# EAGLE board LogicPCB (EAGLE 9.4.2)
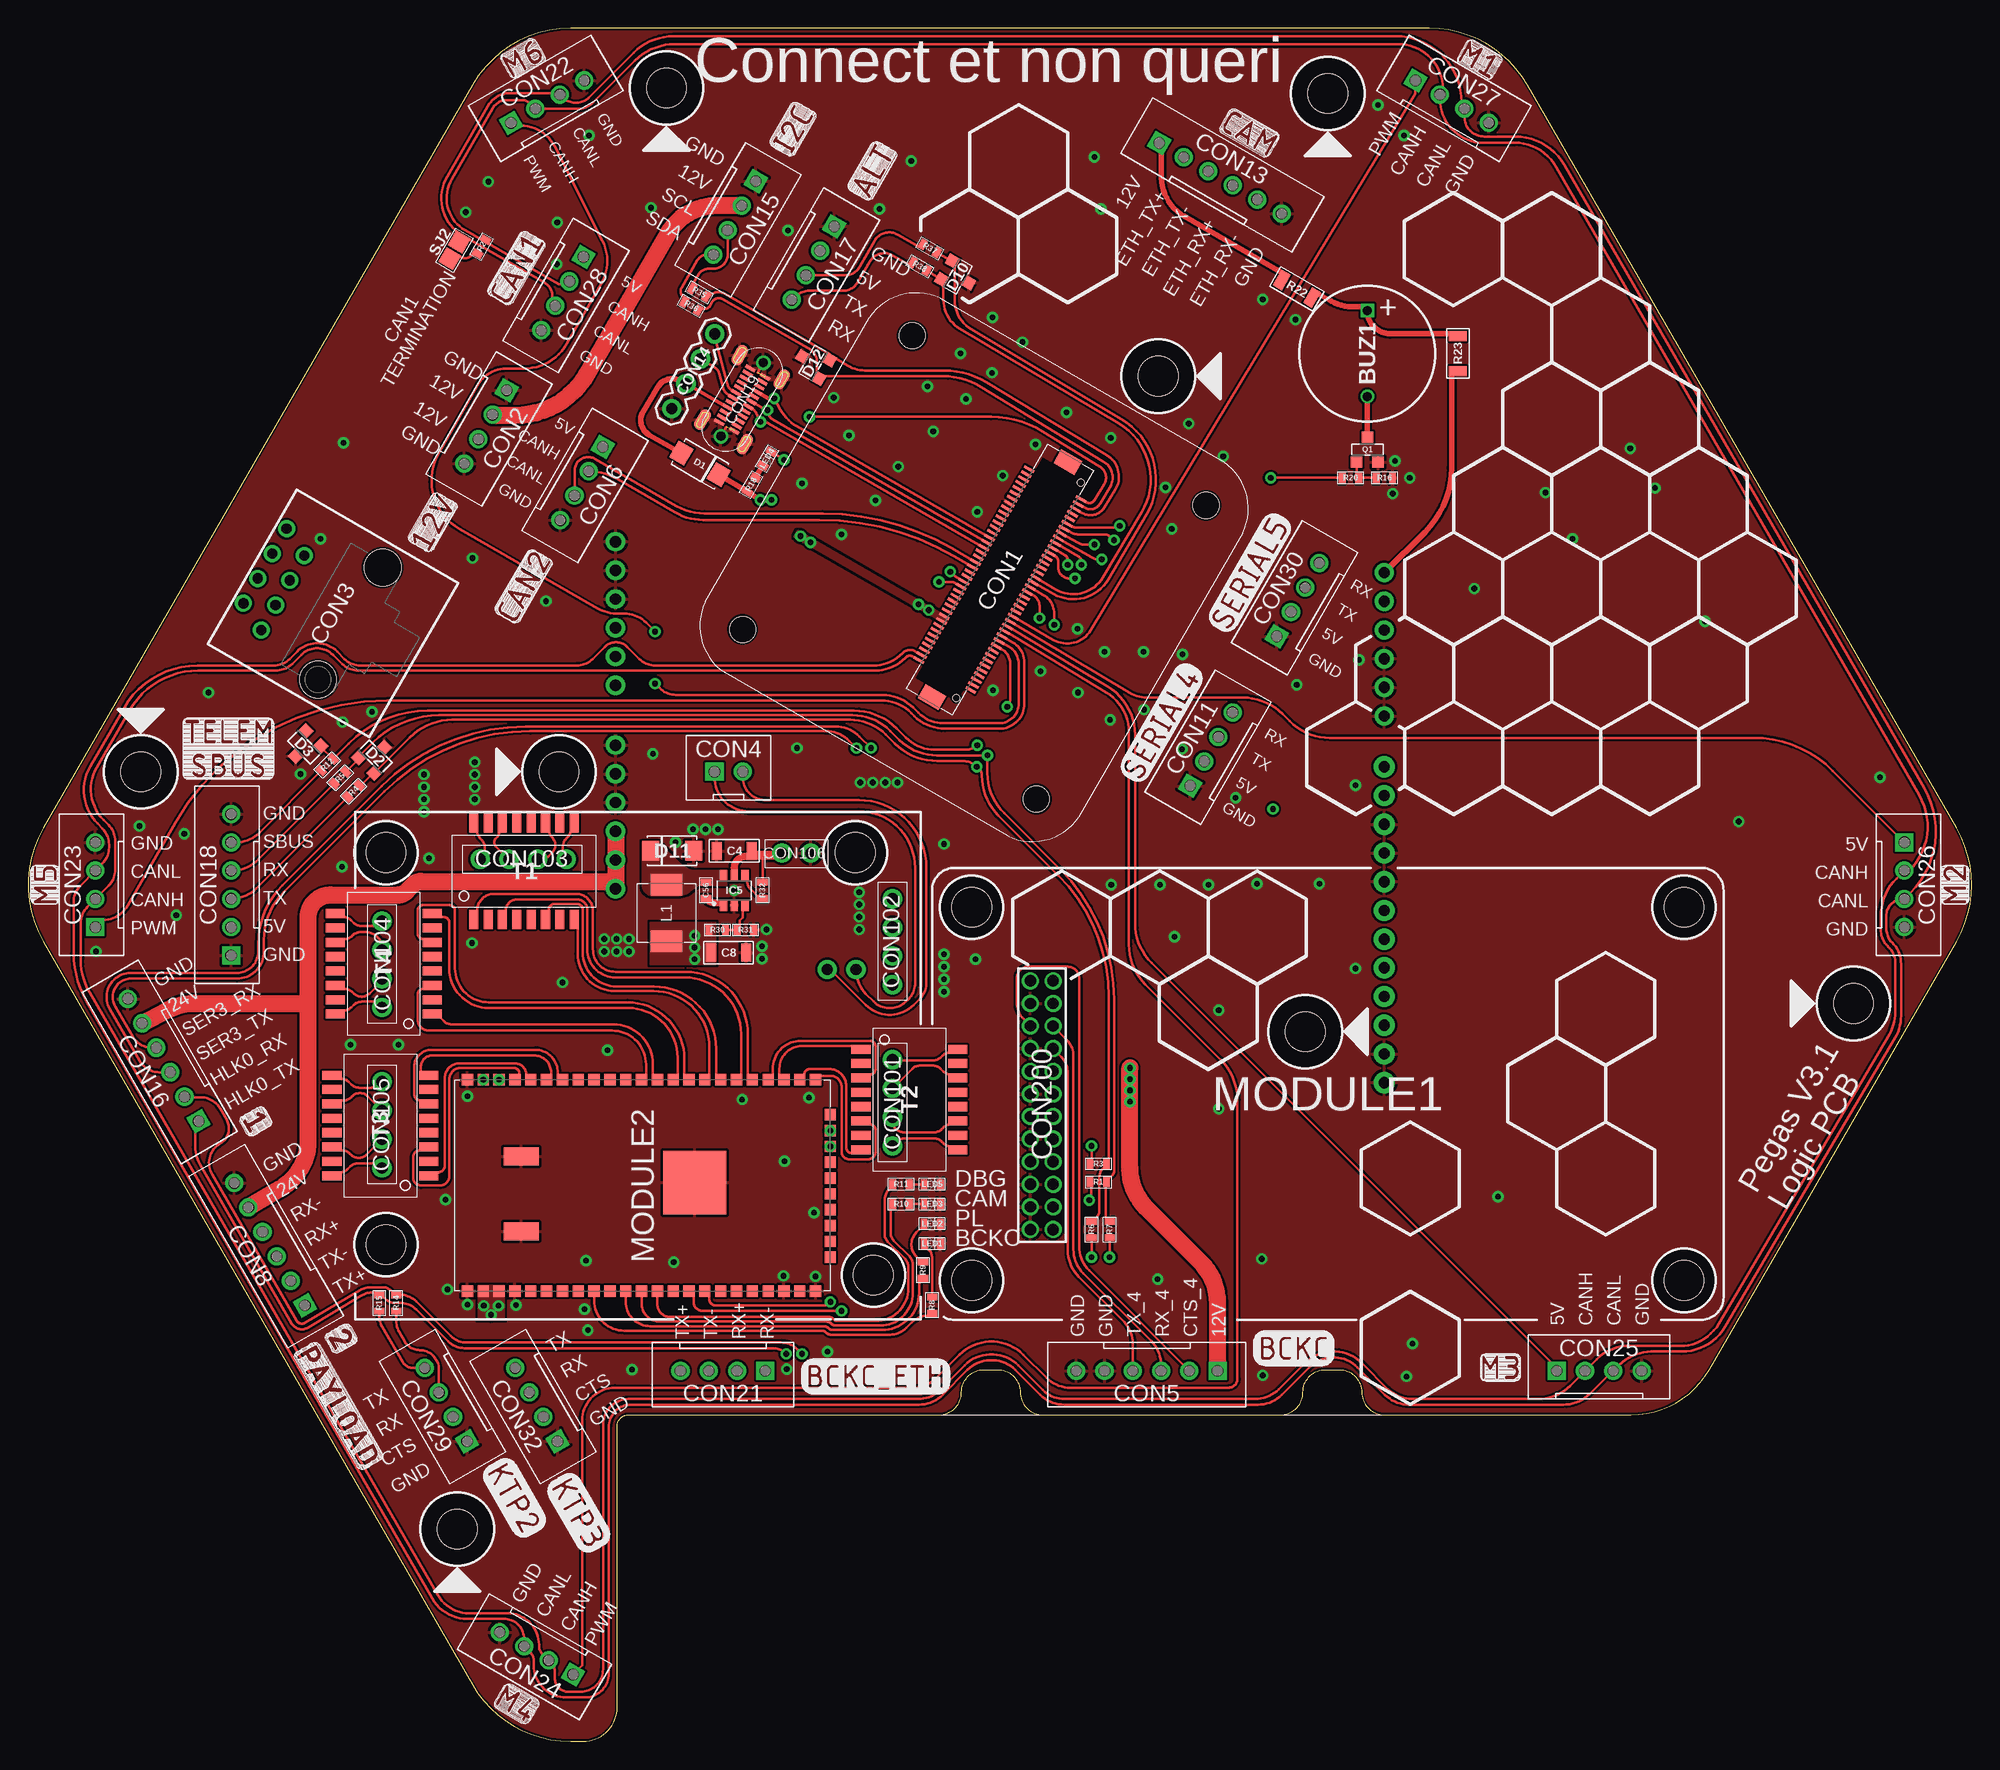
[diagram p2: board, top side]
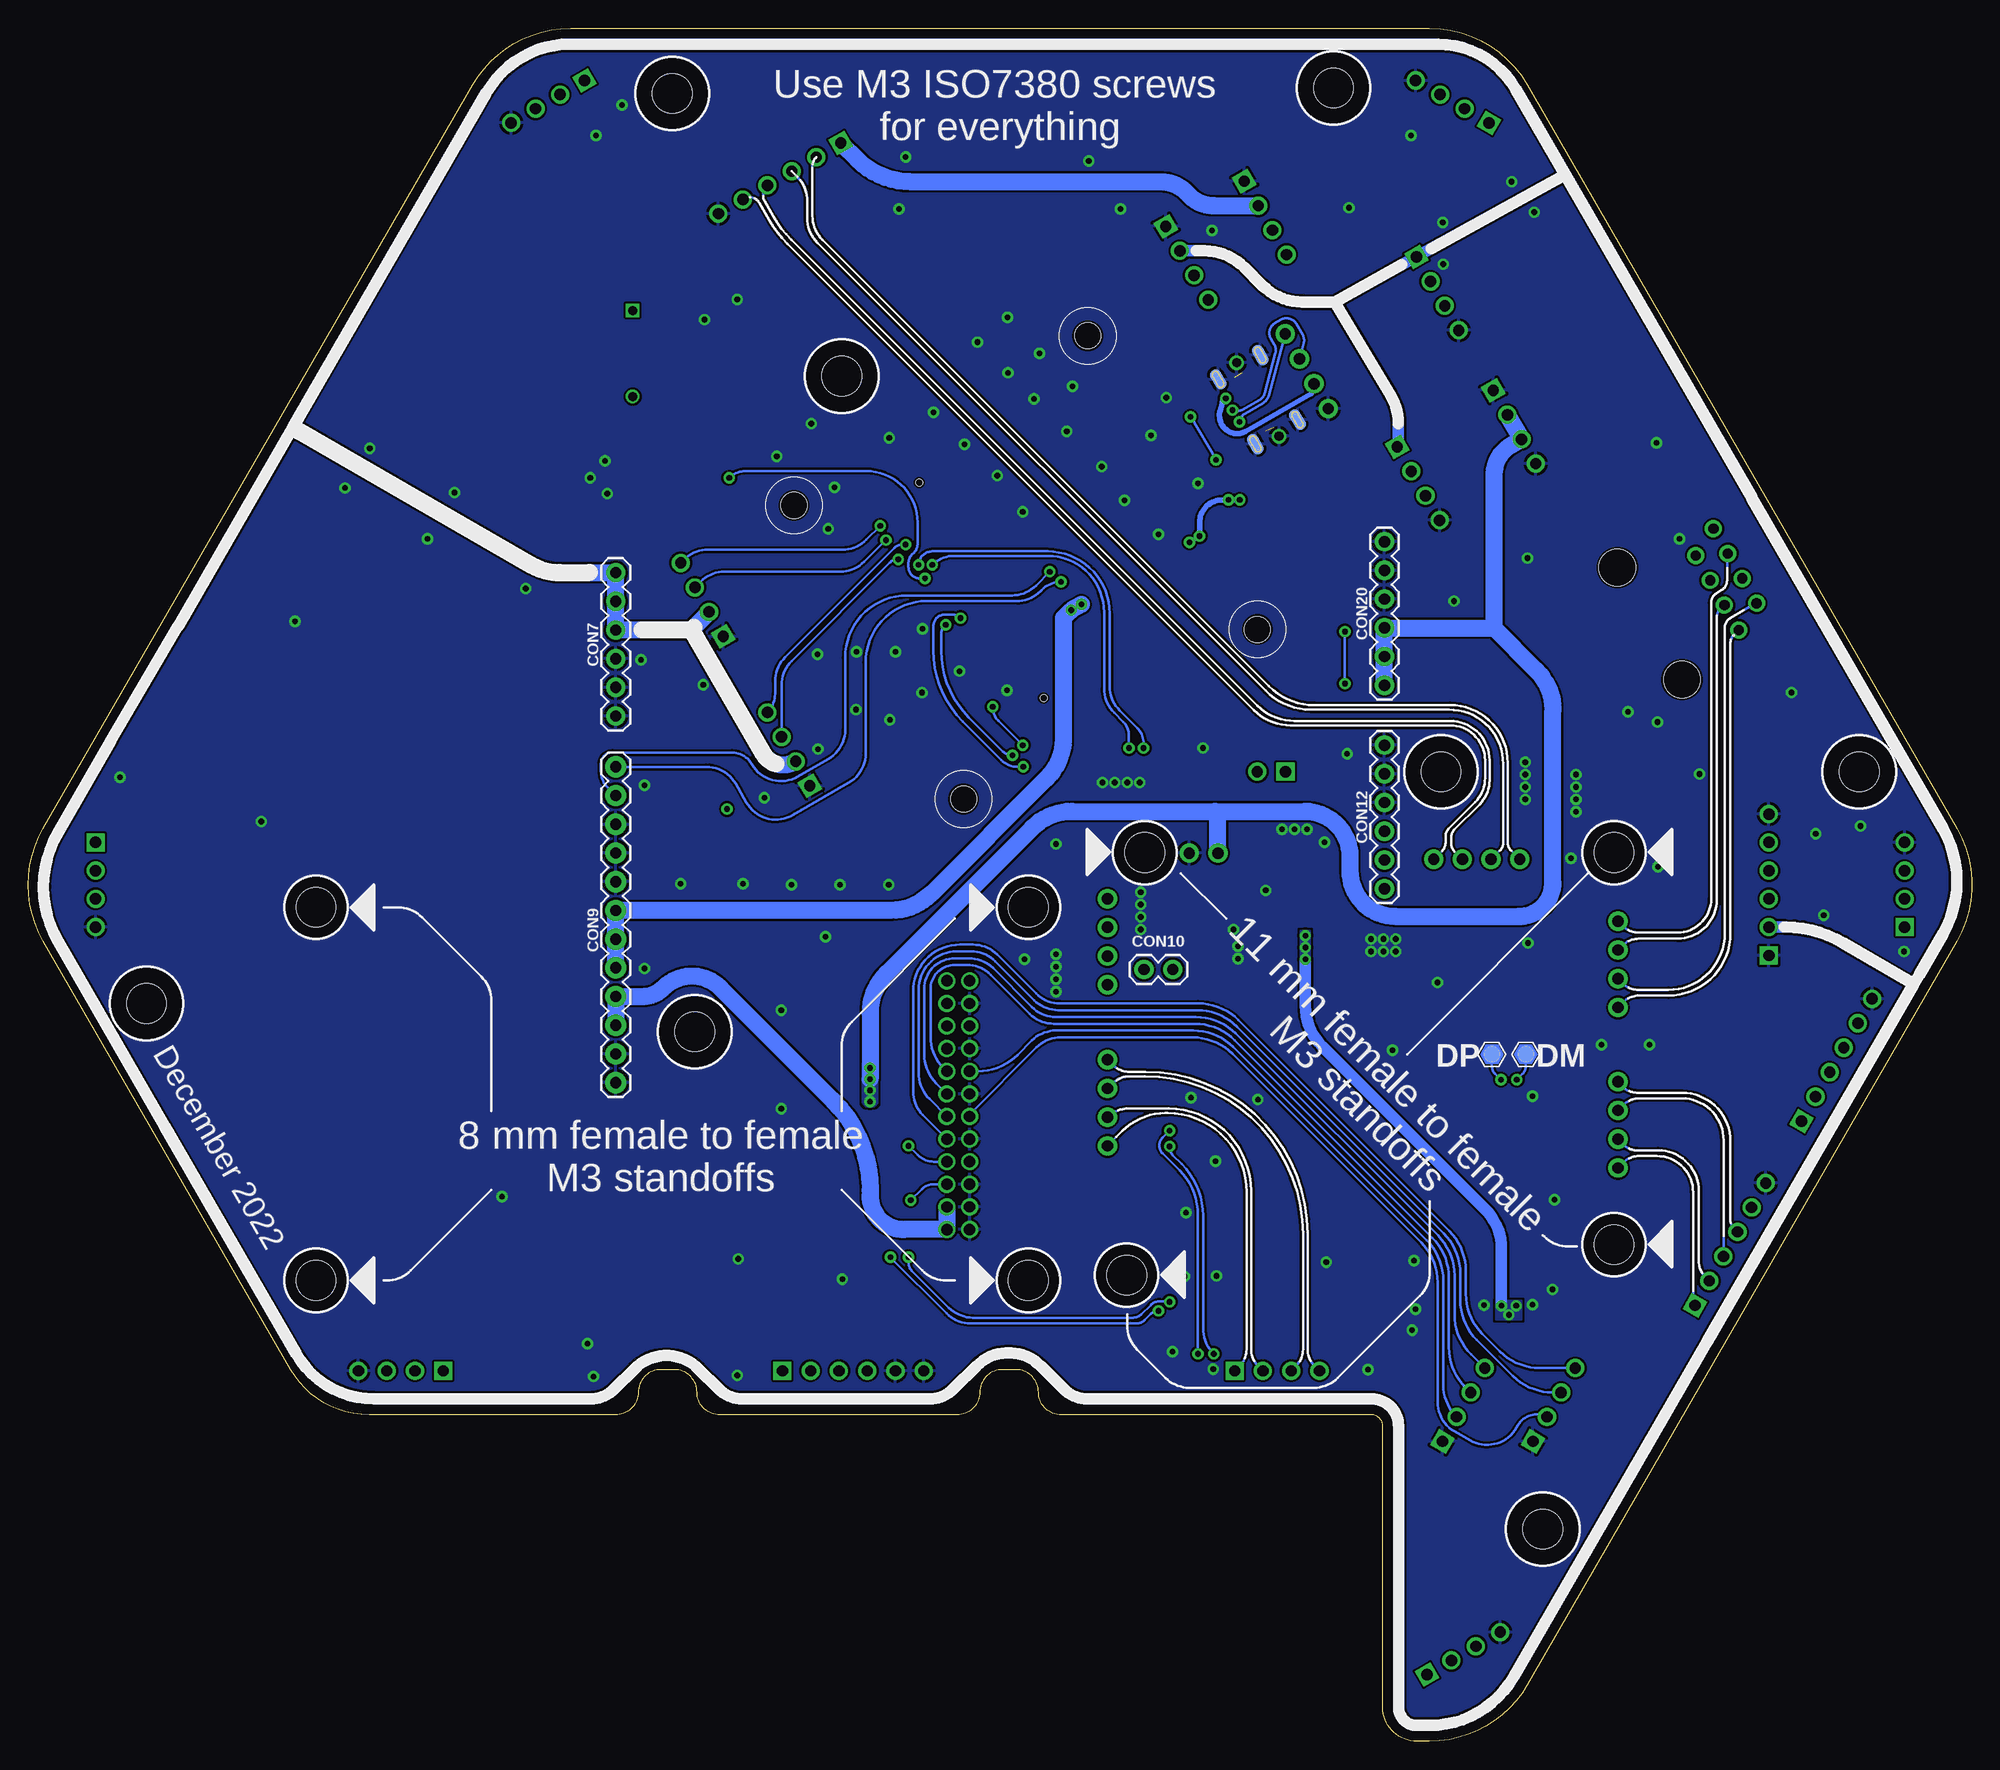
[diagram p3: board, bottom side, seen from below]

Size 171.89 x 151.55 mm. Coordinates in mm from the lower left corner, seen from the top.
Outline: 47.97,0 49.09,0 arc90 52.09,3 52.09,27.88 arc-90 53.09,28.88 80.54,28.88 arc90 82.54,30.88 arc-90 84.54,32.88 85.74,32.88 arc-90 87.74,30.88 arc90 89.74,28.88 110.74,28.88 arc90 112.74,30.88 arc-90 114.74,32.88 115.94,32.88 arc-90 117.94,30.88 arc90 119.94,28.88 141.75,28.88 arc60 148.68,32.88 170.55,70.78 arc60 170.55,80.78 132.58,146.55 arc60 123.92,151.55 47.97,151.55 arc60 39.3,146.55 1.33,80.78 arc60 1.33,70.78 39.3,5 arc60 47.97,0
Copper layers (1*16): Top 0.035mm / dielectric 1.5mm / Bottom 0.035mm
Design rules "JLCPCB 2 layer *": minimum track width 6mil, minimum drill 0.3mm, track to track 0.2mm, track to pad 0.2mm, pad to pad 0.2mm, via to via 0.2mm, smd to smd 0.1mm, copper to edge 0.2mm, drill to drill 6mil, minimum pad ring 0.15mm, minimum via ring 0.15mm, stop-mask expansion 0.05mm, vias tented up to drill 0.5mm, thermal gap 10mil
Net classes: 1 HV: clearance 0.3 mm to class 0, clearance 0.3 mm
Holes 3.5 mm at 9.94,85.78 37.94,18.78 114.94,145.78 161.44,65.28 56.44,146.28 99.94,120.78 46.94,85.78 112.94,62.78 31.64,43.93 73.14,78.63 31.64,78.63 83.44,73.78 146.44,73.78 146.44,40.78 83.44,40.78 74.74,41.23
tRestrict: area 6.7,82.5 to 13.2,89; area 34.7,15.5 to 41.2,22; area 111.7,142.5 to 118.2,149; area 158.2,62 to 164.7,68.5; area 53.2,143 to 59.7,149.5; area 96.7,117.5 to 103.2,124; area 43.7,82.5 to 50.2,89; area 109.7,59.5 to 116.2,66; area 28.8,41.1 to 34.4,46.7; area 28.8,75.8 to 34.4,81.4; area 70.3,75.8 to 75.9,81.4; area 71.9,38.4 to 77.5,44; area 80.6,38 to 86.2,43.6; area 80.6,71 to 86.2,76.6; area 143.6,71 to 149.2,76.6; area 143.6,38 to 149.2,43.6; 1 lines
bRestrict: area 6.7,82.5 to 13.2,89; area 34.7,15.5 to 41.2,22; area 111.7,142.5 to 118.2,149; area 158.2,62 to 164.7,68.5; area 53.2,143 to 59.7,149.5; area 96.7,117.5 to 103.2,124; area 43.7,82.5 to 50.2,89; area 109.7,59.5 to 116.2,66; area 28.8,41.1 to 34.4,46.7; area 28.8,75.8 to 34.4,81.4; area 70.3,75.8 to 75.9,81.4; area 71.9,38.4 to 77.5,44; area 80.6,38 to 86.2,43.6; area 80.6,71 to 86.2,76.6; area 143.6,71 to 149.2,76.6; area 143.6,38 to 149.2,43.6

## Footprints (pad centres in the part's own frame; a part is rotated, then mirrored left to right if it is on the bottom)
BUZZER_12MM = drill 0.8 pad 1.2 square: 1 -3.8,0 | drill 0.8 pad 1.2: 2 3.8,0
C1206 = smd 0.9 x 1.6: P$1 -1.55,0; P$2 1.55,0
C0603 = smd 0.6 x 0.9: 1 -0.725,0; 2 0.725,0
CUBE_ORANGE = smd 0.25 x 1: 1 9.75,2.65; 2 9.75,-2.65; 3 9.25,2.65; 4 9.25,-2.65; 5 8.75,2.65; 6 8.75,-2.65; 7 8.25,2.65; 8 8.25,-2.65; 9 7.75,2.65; 10 7.75,-2.65; 11 7.25,2.65; 12 7.25,-2.65; 13 6.75,2.65; 14 6.75,-2.65; 15 6.25,2.65; 16 6.25,-2.65; 17 5.75,2.65; 18 5.75,-2.65; 19 5.25,2.65; 20 5.25,-2.65; 21 4.75,2.65; 22 4.75,-2.65; 23 4.25,2.65; 24 4.25,-2.65; 25 3.75,2.65; 26 3.75,-2.65; 27 3.25,2.65; 28 3.25,-2.65; 29 2.75,2.65; 30 2.75,-2.65; 31 2.25,2.65; 32 2.25,-2.65; 33 1.75,2.65; 34 1.75,-2.65; 35 1.25,2.65; 36 1.25,-2.65; 37 0.75,2.65; 38 0.75,-2.65; 39 0.25,2.65; 40 0.25,-2.65; 41 -0.25,2.65; 42 -0.25,-2.65; 43 -0.75,2.65; 44 -0.75,-2.65; 45 -1.25,2.65; 46 -1.25,-2.65; 47 -1.75,2.65; 48 -1.75,-2.65; 49 -2.25,2.65; 50 -2.25,-2.65; 51 -2.75,2.65; 52 -2.75,-2.65; 53 -3.25,2.65; 54 -3.25,-2.65; 55 -3.75,2.65; 56 -3.75,-2.65; 57 -4.25,2.65; 58 -4.25,-2.65; 59 -4.75,2.65; 60 -4.75,-2.65; 61 -5.25,2.65; 62 -5.25,-2.65; 63 -5.75,2.65; 64 -5.75,-2.65; 65 -6.25,2.65; 66 -6.25,-2.65; 67 -6.75,2.65; 68 -6.75,-2.65; 69 -7.25,2.65; 70 -7.25,-2.65; 71 -7.75,2.65; 72 -7.75,-2.65; 73 -8.25,2.65; 74 -8.25,-2.65; 75 -8.75,2.65; 76 -8.75,-2.65; 77 -9.25,2.65; 78 -9.25,-2.65; 79 -9.75,2.65; 80 -9.75,-2.65 | smd 1.4 x 2.1: P1 -12,0; P2 12,0 | hole 0.6: -11,-1.9; 11,-1.9 | hole 2.3: -15.2,17.5; 14.8,17.5; 14.8,-12.5; -15.2,-12.5
B04B-XASK-1 = drill 1 pad 1.6 square: 1 -3.75,0 | drill 1 pad 1.6: 2 -1.25,0; 3 1.25,0; 4 3.75,0
5556416-1 = drill 0.9 pad 1.5: 1 -4.44,4.76; 2 -3.17,7.3; 3 -1.9,4.76; 4 -0.63,7.3; 5 0.64,4.76; 6 1.91,7.3; 7 3.18,4.76; 8 4.45,7.3 | hole 3.25: -5.715,-1.778; 5.715,-1.778
B02B-XASK-1 = drill 1 pad 1.6 square: 1 -1.25,0 | drill 1 pad 1.6: 2 1.25,0
B06B-XASK-1 = drill 1 pad 1.6 square: 1 -6.25,0 | drill 1 pad 1.6: 2 -3.75,0; 3 -1.25,0; 4 1.25,0; 5 3.75,0; 6 6.25,0
1X06-PTH-2.54 = drill 1 pad 1.7: 1 -6.35,0; 2 -3.81,0; 3 -1.27,0; 4 1.27,0; 5 3.81,0; 6 6.35,0
1X12-PTH-2.54 = drill 1 pad 1.88: 1 -13.97,0; 2 -11.43,0; 3 -8.89,0; 4 -6.35,0; 5 -3.81,0; 6 -1.27,0; 7 1.27,0; 8 3.81,0; 9 6.35,0; 10 8.89,0; 11 11.43,0; 12 13.97,0
1X02-PTH-2.54 = drill 1 pad 1.7: 1 -1.27,0; 2 1.27,0
1X04-PTH-2.54 = drill 1 pad 1.7: 1 -3.81,0; 2 -1.27,0; 3 1.27,0; 4 3.81,0
2047110001-PROD = smd 0.3 x 0.95: A1 -2.75,0.755; A2 -2.25,0.755; A3 -1.75,0.755; A4 -1.25,0.755; A5 -0.75,0.755; A6 -0.25,0.755; A7 0.25,0.755; A8 0.75,0.755; A9 1.25,0.755; A10 1.75,0.755; A11 2.25,0.755; A12 2.75,0.755; B1 2.75,-0.755; B2 2.25,-0.755; B3 1.75,-0.755; B4 1.25,-0.755; B5 0.75,-0.755; B6 0.25,-0.755; B7 -0.25,-0.755; B8 -0.75,-0.755; B9 -1.25,-0.755; B10 -1.75,-0.755; B11 -2.25,-0.755; B12 -2.75,-0.755 | smd 1.9 x 1: G1 -3.3,2.15; G4 3.3,2.15; G7 -3.3,-2.15; G9 3.3,-2.15 | smd 1.9 x 1 bottom: G2 -3.3,2.15; G5 3.3,2.15; G8 -3.3,-2.15; G10 3.3,-2.15 | drill 0.8 pad 1.3: P$1 -3.75,0; P$2 3.75,0
DO-214AC(SMA) = smd 1.5 x 1.7: A -1.9,0; C 1.9,0
SOT23B-3 = smd 1 x 1: 1 -0.95,-1.1; 2 0.95,-1.1; 3 0,1.1
SOT23-6 = smd 1 x 0.65: 1 1.3,-0.95; 2 1.3,0; 3 1.3,0.95; 4 -1.3,0.95; 5 -1.3,0; 6 -1.3,-0.95
IHLP-2020BZ-01 = smd 1.9 x 2.8: P$1 -2.5,0; P$2 2.5,0
LED0603 = smd 0.6 x 0.9: A 0.725,0; C -0.725,0
05G_ETH_SWITCH = drill 1 pad 1.7: GND -15.27,-18.8; J1.1 -22.5,-0.52; J1.2 -22.5,2.02; J1.3 -22.5,4.56; J1.6 -22.5,7.1; J2.1 -22.5,-14.77; J2.2 -22.5,-12.23; J2.3 -22.5,-9.69; J2.6 -22.5,-7.15; J3.1 13.97,-18.25; J3.2 11.43,-18.25; J3.3 8.89,-18.25; J3.6 6.35,-18.25; J4.1 22.65,-5.15; J4.2 22.65,-7.69; J4.3 22.65,-10.23; J4.6 22.65,-12.77; J5.1 22.65,9.05; J5.2 22.65,6.51; J5.3 22.65,3.97; J5.6 22.65,1.43; SUP -12.73,-18.8
MODEM_CARRIER = drill 1: 1 -24.3,10; 2 -26.3,10; 3 -24.3,8; 4 -26.3,8; 5 -24.3,6; 6 -26.3,6; 7 -24.3,4; 8 -26.3,4; 9 -24.3,2; 10 -26.3,2; 11 -24.3,0; 12 -26.3,0; 13 -24.3,-2; 14 -26.3,-2; 15 -24.3,-4; 16 -26.3,-4; 17 -24.3,-6; 18 -26.3,-6; 19 -24.3,-8; 20 -26.3,-8; 21 -24.3,-10; 22 -26.3,-10; 23 -24.3,-12; 24 -26.3,-12
HLK-7688A = smd 1 x 1: 1 15.5,9.35; 2 14.1,9.35; 3 12.7,9.35; 4 11.3,9.35; 5 9.9,9.35; 6 8.5,9.35; 7 7.1,9.35; 8 5.7,9.35; 9 4.3,9.35; 10 2.9,9.35; 11 1.5,9.35; 12 0.1,9.35; 13 -1.3,9.35; 14 -2.7,9.35; 15 -4.1,9.35; 16 -5.5,9.35; 17 -6.9,9.35; 18 -8.3,9.35; 19 -9.7,9.35; 20 -11.1,9.35; 21 -12.5,9.35; 22 -13.9,9.35; 23 -15.3,9.35; 24 -16.6,6.35; 25 -16.6,4.95; 26 -16.6,3.55; 27 -16.6,2.15; 28 -16.6,0.75; 29 -16.6,-0.65; 30 -16.6,-2.05; 31 -16.6,-3.45; 32 -16.6,-4.85; 33 -16.6,-6.25; 34 -15.3,-9.35; 35 -13.9,-9.35; 36 -12.5,-9.35; 37 -11.1,-9.35; 38 -9.7,-9.35; 39 -8.3,-9.35; 40 -6.9,-9.35; 41 -5.5,-9.35; 42 -4.1,-9.35; 43 -2.7,-9.35; 44 -1.3,-9.35; 45 0.1,-9.35; 46 1.5,-9.35; 47 2.9,-9.35; 48 4.3,-9.35; 49 5.7,-9.35; 50 7.1,-9.35; 51 8.5,-9.35; 52 9.9,-9.35; 53 11.3,-9.35; 54 12.7,-9.35; 55 14.1,-9.35; 56 15.5,-9.35 | smd 5.6 x 5.6: P$1 -4.6,-0.25 | smd 3.1 x 1.6: P$2 10.75,4.05; P$3 10.75,-2.55
HEX-2MM = smd 1.5 x 1.5: 1 0,0
SOT23 = smd 1 x 1: 1 1.1,-0.95; 2 1.1,0.95; 3 -1.1,0
R0603 = smd 0.6 x 0.9: 1 -0.725,0; 2 0.725,0
R1206 = smd 0.9 x 1.6: P$1 -1.55,0; P$2 1.55,0
RES_0 = smd 1.5 x 1.5: 1 -0.85,0; 2 0.85,0
H1102 = smd 0.8 x 1.7: 1 -4.445,-4.28; 2 -3.175,-4.28; 3 -1.905,-4.28; 4 -0.635,-4.28; 5 0.635,-4.28; 6 1.905,-4.28; 7 3.175,-4.28; 8 4.445,-4.28; 9 4.445,4.28; 10 3.175,4.28; 11 1.905,4.28; 12 0.635,4.28; 13 -0.635,4.28; 14 -1.905,4.28; 15 -3.175,4.28; 16 -4.445,4.28

## Placement (x,y rotation side)
BUZ1  BUZZER-ЕР-12MM  [BUZZER_12MM]  118.44,122.78 270 top
C4  10u  [C1206]  62.44,78.78 0 top  (not fitted)
C8  47u  [C1206]  61.94,69.78 0 top  (not fitted)
C56  10n  [C0603]  59.94,75.28 270 top  (not fitted)
CON1  CUBE_ORANGE_  [CUBE_ORANGE]  85.94,102.78 60 top
CON2  CON-4P-JST-XA  [B04B-XASK-1]  40.44,116.28 240 top
CON3  RJ45-NO_SHIELD-5556416-1  [5556416-1]  26.94,99.78 60 top
CON4  CON-2P-JST-XA  [B02B-XASK-1]  61.94,85.78 0 top
CON5  CON-6P-JST-XA  [B06B-XASK-1]  98.94,32.78 180 top
CON6  CON-4P-JST-XA  [B04B-XASK-1]  48.94,111.28 240 top
CON7  PINHEAD_1X06-2.54  [1X06-PTH-2.54]  119.94,97.05 90 bottom
CON8  CON-6P-JST-XA  [B06B-XASK-1]  21.34,43.98 120 top
CON9  PINHEAD_1X12-2.54  [1X12-PTH-2.54]  119.94,72.24 270 bottom
CON10  PINHEAD_1X02-2.54  [1X02-PTH-2.54]  71.94,68.28 0 bottom
CON11  CON-4P-JST-XA  [B04B-XASK-1]  104.64,87.78 60 top
CON12  PINHEAD_1X06-2.54  [1X06-PTH-2.54]  51.94,81.78 270 bottom
CON13  CON-6P-JST-XA  [B06B-XASK-1]  105.44,138.28 330 top
CON14  PINHEAD_1X04-2.54  [1X04-PTH-2.54]  58.82,121.2 60 top  (not fitted)
CON15  CON-4P-JST-XA  [B04B-XASK-1]  62.48,134.78 240 top
CON16  CON-6P-JST-XA  [B06B-XASK-1]  11.94,60.28 120 top
CON17  CON-4P-JST-XA  [B04B-XASK-1]  69.41,130.78 240 top
CON18  CON-6P-JST-XA  [B06B-XASK-1]  17.94,75.78 90 top
CON19  USB-TYPE-C-VERT-PROD  [2047110001-PROD]  63.15,118.7 60 top
CON20  PINHEAD_1X06-2.54  [1X06-PTH-2.54]  51.94,99.78 90 bottom
CON21  CON-4P-JST-XA  [B04B-XASK-1]  61.44,32.78 180 top
CON22  CON-4P-JST-XA  [B04B-XASK-1]  45.94,145.06 30 top
CON23  CON-4P-JST-XA  [B04B-XASK-1]  5.94,75.78 90 top
CON24  CON-4P-JST-XA  [B04B-XASK-1]  44.94,7.78 150 top
CON25  CON-4P-JST-XA  [B04B-XASK-1]  138.94,32.78 0 top
CON26  CON-4P-JST-XA  [B04B-XASK-1]  165.94,75.78 270 top
CON27  CON-4P-JST-XA  [B04B-XASK-1]  125.94,145.06 330 top
CON28  CON-4P-JST-XA  [B04B-XASK-1]  47.24,128.08 240 top
CON29  CON-4P-JST-XA  [B04B-XASK-1]  36.94,29.78 120 top
CON30  CON-4P-JST-XA  [B04B-XASK-1]  112.31,101 60 top
CON32  CON-4P-JST-XA  [B04B-XASK-1]  44.94,29.78 120 top
D1  SS34  [DO-214AC(SMA)]  59.41,113.02 330 top
D2  ESDA5V3L  [SOT23B-3]  30.7,87.12 315 top  (not fitted)
D3  ESDA5V3L  [SOT23B-3]  24.42,87.94 135 top
D10  ESDA5V3L  [SOT23B-3]  82.22,129.59 240 top
D11  SS34  [DO-214AC(SMA)]  56.94,78.78 180 top  (not fitted)
D12  ESDA5V3L  [SOT23B-3]  69.44,121.95 60 top
IC5  AOZ1280  [SOT23-6]  62.44,75.28 270 top  (not fitted)
L1  3.3uH  [IHLP-2020BZ-01]  56.44,73.28 270 top  (not fitted)
LED1  LED-0603  [LED0603]  79.94,44.03 180 top  (not fitted)
LED2  LED-0603  [LED0603]  79.94,45.78 180 top  (not fitted)
LED3  LED-0603  [LED0603]  79.94,47.53 180 top  (not fitted)
LED4  LED-0603  [LED0603]  65.34,113.48 240 top
LED5  LED-0603  [LED0603]  79.94,49.28 180 top  (not fitted)
M1  05G_ETHERNET_SWITCH  [05G_ETH_SWITCH]  53.94,59.78 180 top
MODULE1  MODEM_CARRIER  [MODEM_CARRIER]  114.94,57.28 0 top
MODULE2  HLK-7688A  [HLK-7688A]  54.34,49.18 180 top  (not fitted)
PAD1  PAD-HEX-2MM  [HEX-2MM]  42.44,60.78 270 bottom  (not fitted)
PAD2  PAD-HEX-2MM  [HEX-2MM]  39.44,60.78 270 bottom  (not fitted)
Q1  IRLML0030  [SOT23]  118.44,114.28 270 top
R1  120R  [R0603]  94.64,49.48 0 top
R2  120R  [R0603]  40.09,132.23 240 top
R3  120R  [R0603]  94.64,51.08 0 top
R4  120R  [R0603]  28.77,84.05 45 top  (not fitted)
R5  120R  [R0603]  27.58,85.24 45 top  (not fitted)
R6  120R  [R0603]  94.04,45.28 90 top  (not fitted)
R7  120R  [R0603]  95.64,45.28 90 top  (not fitted)
R8  1K  [R0603]  79.94,38.58 270 top  (not fitted)
R9  1K  [R0603]  79.14,41.68 270 top  (not fitted)
R10  1K  [R0603]  77.19,47.53 180 top  (not fitted)
R11  1K  [R0603]  77.19,49.28 180 top  (not fitted)
R12  120R  [R0603]  26.44,86.38 45 top
R14  120R  [R0603]  32.54,38.78 270 top  (not fitted)
R15  120R  [R0603]  31.04,38.78 270 top  (not fitted)
R16  51K  [R0603]  119.94,111.78 180 top
R18  1K  [R0603]  63.94,111.18 60 top
R20  120R  [R0603]  116.94,111.78 180 top
R22  200R  [R1206]  112.21,128.5 150 top
R23  DNM  [R1206]  126.44,122.78 270 top  (not fitted)
R30  51K  [R0603]  60.94,71.78 180 top  (not fitted)
R31  16K  [R0603]  63.44,71.78 0 top  (not fitted)
R32  51K  [R0603]  64.94,75.28 90 top  (not fitted)
R35  120R  [R0603]  59.34,128.18 330 top
R36  120R  [R0603]  58.64,126.98 330 top
R37  120R  [R0603]  79.74,132.08 330 top
R38  120R  [R0603]  78.84,130.48 330 top
SJ2  [RES_0]  37.7,131.91 60 top  (not fitted)
T1  H1102NL  [H1102]  43.84,76.98 0 top  (not fitted)
T2  H1102NL  [H1102]  77.94,56.78 270 top  (not fitted)
T3  H1102NL  [H1102]  31.14,54.48 90 top  (not fitted)
T4  H1102NL  [H1102]  31.44,68.78 90 top  (not fitted)

## Tracks (layer width: path | path; a pad name or v marks a point on that pad's centre or on a via)
5VFMU  (via drill 0.5 pad 1)
  Top 0.5: D1.C R18.1 v64.74,109.83 v65.74,109.83
  Bottom 0.5: v69.19,106.08 v68.29,106.63 68.29,107.83 arc90 66.29,109.83 v64.74,109.83
  Bottom 1.5: v78.74,100.58 v79.64,100.08 80.34,99.38 80.34,88.75 arc45 81.81,85.21 92.05,74.97 arc45 95.58,73.51 CON9.6 CON9.7 CON9.8
  pour Top (no thermals): 81.1,98.91 67.78,106.6 68.06,107.08 81.38,99.39
!FMU_LED_AMBER  (via drill 0.5 pad 1)
  Top 0.2: v69.09,117.18 85.16,117.18 arc-32 89.74,115.88 94.78,112.78 arc-90 95.16,111.22 94.29,109.78 arc-88 93.63,109.61 CON1.2 | LED4.C v66.84,113.38
  Bottom 0.2: v66.84,113.38 v69.09,117.18
ALARM  (via drill 0.5 pad 1)
  Top 0.2: CON1.24 90.38,105.13 90.85,104.85 arc-59 91.09,104.42 91.09,103.88 arc90 92.09,102.88 v92.59,102.88 | R20.2 v109.89,111.78
  Bottom 0.2: v92.59,102.88 93.04,102.88 arc90 94.04,103.88 94.04,104.26 arc45 93.75,104.97 93.53,105.18 arc-45 93.24,105.89 93.24,107.83 arc-90 97.79,112.38 108.46,112.38 arc-45 109.88,111.79 v109.89,111.78
BATT_CURRENT  (via drill 0.5 pad 1)
  Top 0.2: CON1.49 81.81,102.58 v80.54,102.58
  Bottom 0.2: v80.54,102.58 arc-45 82.25,101.87 82.36,101.76 arc45 84.48,100.88 92.42,100.88 arc-90 97.82,95.48 97.82,87.4 arc60 99.32,84.8 104.27,81.95 arc90 108.37,83.04 109.33,84.71 arc-60 111.93,86.21 CON9.1
BATT_VOLTAGE  (via drill 0.5 pad 1)
  Top 0.2: CON1.47 81.94,103.08 v81.54,103.48
  Bottom 0.2: v81.54,103.48 82.76,102.26 arc45 84.88,101.38 94.14,101.38 arc-90 99.64,95.88 99.64,89.49 arc60 101.14,86.9 103.82,85.35 arc90 107.91,86.45 107.92,86.48 arc-60 109.66,87.48 120.24,87.48 arc-90 121.24,86.48 121.24,85.8 arc-45 120.66,84.38 CON9.2
CAN1_H
  Top 0.2: 40.33,132.7 38.65,133.67 arc-90 37.44,138.19 41.07,144.46 arc-60 42.35,145.2 43.67,145.2 arc-45 44.38,144.91 CON22.2 44.87,144.42 48.56,144.42 arc45 49.97,145.01 53.65,148.69 arc-45 57.19,150.15 121.16,150.15 arc-90 125.11,146.2 125.11,145.93 CON27.2 124.86,145.28 arc90 128.71,141.43 131.44,141.43 arc-60 135.17,139.28 167.25,83.7 arc-75 166.37,77.03 CON26.2 165.25,76.33 arc45 163.84,72.94 163.84,71.84 arc45 164.45,70.37 164.53,70.29 arc-45 165.14,68.81 165.14,64.51 arc-30 164.63,62.6 149.54,36.95 arc-60 146.09,34.98 141.55,34.98 arc45 138.72,33.81 CON25.2 136.37,31.46 arc-45 133.53,30.28 122.38,30.28 arc-45 120.26,31.16 117.97,33.45 arc90 112.91,33.45 110.62,31.16 arc-45 108.5,30.28 91.68,30.28 arc-45 89.73,31.09 87.57,33.25 arc90 82.82,33.25 80.65,31.09 arc-45 78.7,30.28 53.09,30.28 arc90 50.84,28.03 50.84,6.38 arc-90 48.84,4.38 47.77,4.38 arc-90 46.57,5.58 46.57,6.19 arc45 46.28,6.9 CON24.2 45.47,7.71 arc-45 45.17,8.42 45.17,8.53 arc90 42.37,11.33 39.02,11.33 arc-60 36.21,12.95 5.43,66.23 arc-30 4.64,69.18 4.64,72.4 arc-45 5.22,73.81 CON23.2 7.11,75.69 arc45 7.69,77.11 7.69,79.65 arc45 7.11,81.06 6.67,81.5 arc-75 6.05,86.16 8.09,89.69 8.98,91.23 arc-60 15.04,94.73 21.91,94.73 arc45 23.33,95.31 24.13,96.11 arc-90 26.96,96.11 27.76,95.31 arc45 29.17,94.73 74.87,94.73 arc45 77.55,95.84 77.61,95.9 arc-75 78.21,95.98 CON1.79 | 40.33,132.7 46.92,128.9 47.23,128.9 arc45 CON28.2 | R2.1 40.33,132.73 40.33,132.7
CAN1_L
  Top 0.2: CON26.3 166.46,75.05 arc75 167.69,84.35 135.86,139.48 arc60 131.53,141.98 128.77,141.98 arc-90 127.02,143.73 CON27.3 126.77,144.68 126.77,145 arc90 120.92,150.85 57.09,150.85 arc45 53.55,149.39 49.59,145.43 arc-90 47.28,145.43 CON22.3 46.88,145.83 42.64,145.83 arc60 40.64,144.67 37.04,138.43 arc90 38.44,133.2 38.45,133.21 38.6,133.13 | CON26.3 | 38.6,133.13 45.67,129.04 arc-60 46.37,127.84 46.37,127.24 CON28.3 | SJ2.2 38.6,133.11 38.6,133.13 | CON1.77 78.47,96.42 arc76 77.35,96.29 77.33,96.27 arc-45 74.7,95.18 55.46,95.18 arc-45 54.05,95.76 52.99,96.82 arc90 50.98,96.82 49.93,95.76 arc-45 48.51,95.18 29.37,95.18 arc-45 27.96,95.76 27.31,96.41 arc90 23.77,96.41 23.13,95.76 arc-45 21.71,95.18 14.97,95.18 arc60 8.47,91.43 5.47,86.23 arc75 6.14,81.18 6.56,80.76 arc-45 7.14,79.35 7.14,79.06 arc-45 6.56,77.64 CON23.3 4.6,75.69 arc45 4.01,74.27 4.01,69.71 arc30 5.14,65.51 35.73,12.63 arc60 38.85,10.83 42.06,10.83 arc-90 43.86,9.03 CON24.3 44.42,7.85 arc-45 44.71,7.14 44.71,6.73 arc90 47.56,3.88 49.24,3.88 arc90 51.34,5.98 51.34,27.83 arc-90 53.29,29.78 78.76,29.78 arc45 80.89,30.66 83.07,32.84 arc-90 87.31,32.84 89.5,30.66 arc45 91.62,29.78 108.76,29.78 arc45 110.89,30.66 113.32,33.09 arc-90 117.56,33.09 120,30.66 arc45 122.12,29.78 135.76,29.78 arc45 138.12,30.76 140.14,32.78 CON25.3 140.72,33.31 arc-45 143.55,34.48 146.22,34.48 arc60 150.1,36.7 165.13,62.26 arc30 165.64,64.17 165.64,68.77 arc45 164.86,70.66 164.85,70.67 arc-45 164.34,71.9 164.34,73.03 arc-90 165.84,74.53 CON26.3
CAN2_H
  Top 0.2: CON1.41 81.92,104.82 arc30 69.98,108.06 59.69,108.06 arc-32 57.19,108.73 52.13,111.65 52.07,111.69 arc30 CON6.2 | CON6.2
CAN2_L
  Top 0.2: CON1.39 81.67,105.55 arc30 70.27,108.63 59.82,108.63 arc-30 57.32,109.3 50.13,113.45 arc120 48.32,112.41 CON6.3
CTS_2
  Bottom 0.2: MODULE1.14 88.64,55.48 82.72,61.4 arc45 80.6,62.28 68.91,62.28 arc45 65.38,60.81 48.71,44.14 arc45 47.24,40.61 47.24,30.02 arc-60 45.74,27.42 44.37,26.63 arc-90 40.28,27.73 40.14,27.97 arc88 CON29.2
CTS_3
  Bottom 0.2: MODULE1.10 87.91,59.28 arc-45 84.38,60.74 83.12,62 arc45 81,62.88 68.83,62.88 arc45 65.3,61.41 48.21,44.32 arc45 46.74,40.79 46.74,31.53 arc-45 CON32.2
CTS_4
  Top 0.2: CON5.2 93.82,41.65 arc-45 92.94,43.77 92.94,67.53 arc90 91.94,68.53 88.44,68.53 arc90 87.44,67.53 87.44,65.31 arc45 88.03,63.89 MODULE1.6
DBG_ETH_RX+
  Top 0.2: M1.J4.1 30.79,65.43 29.48,65.43 arc45 28.77,65.14 28.55,64.93 arc-45 27.85,64.63 27.46,64.63 T4.16
  Bottom 0.2: CON3.1 21.05,97.86 arc-45 21.34,97.16 21.34,71.48 arc90 26.84,65.98 29.41,65.98 arc-45 30.83,65.39 M1.J4.1
DBG_ETH_RX-
  Top 0.2: M1.J4.2 arc-45 31.15,67.13 30.19,66.17 arc-45 29.48,65.87 29.48,65.87 arc-45 28.77,66.17 28.65,66.28 arc45 27.95,66.57 27.46,66.57 T4.14
  Bottom 0.2: M1.J4.2 30.89,67.06 arc-45 29.47,66.48 26.84,66.48 arc-90 21.84,71.48 21.84,98.52 arc60 21.34,99.38 19.09,100.68 CON3.2
DBG_ETH_TX+
  Top 0.2: M1.J4.3 31.29,70.18 arc90 29.89,71.58 29.38,71.58 arc45 28.67,71.29 28.65,71.28 arc-45 27.95,70.98 27.46,70.98 T4.11
  Bottom 0.2: CON3.3 21.97,100.41 22.09,100.34 arc-57 22.54,99.5 22.54,74.51 arc90 26.04,71.01 29.46,71.01 arc-45 30.88,70.42 M1.J4.3
DBG_ETH_TX-
  Top 0.2: M1.J4.6 31.16,72.42 arc-45 30.45,72.12 29.48,72.12 arc-45 28.77,72.42 28.55,72.63 arc45 27.85,72.92 27.46,72.92 T4.9
  Bottom 0.2: CON3.6 21.64,105.01 21.64,102.69 arc60 22.14,101.83 22.54,101.6 arc-60 23.04,100.73 23.04,74.55 arc90 26.04,71.55 29.46,71.55 arc45 30.88,72.13 M1.J4.6
ETH1_RX+
  Top 0.2: T2.11 81.92,54.57 81.64,54.57 arc45 80.93,54.28 80.81,54.17 arc-45 80.11,53.87 77.44,53.87 arc-90 76.44,54.87 M1.J1.3
  Bottom 0.2: CON21.2 63.16,33.24 arc45 63.74,34.66 63.74,48.68 arc-90 71.04,55.98 74.61,55.98 arc-45 M1.J1.3
ETH1_RX-
  Top 0.2: M1.J1.6 76.8,53.04 arc-45 77.51,53.33 80.11,53.33 arc-45 80.81,53.04 80.93,52.93 arc45 81.64,52.63 81.92,52.63 T2.9
  Bottom 0.2: CON21.1 64.73,33.24 arc-45 64.14,34.66 64.14,48.58 arc-90 71.14,55.58 71.32,55.58 arc-45 75.12,54 M1.J1.6
ETH1_TX+
  Top 0.2: T2.16 81.92,60.92 81.54,60.92 arc45 80.83,60.63 80.71,60.52 arc-45 80.01,60.22 76.52,60.22 M1.J1.1
  Bottom 0.2: M1.J1.1 76.01,59.86 arc-45 74.47,59.23 73.09,59.23 arc90 58.74,44.88 58.74,34.66 arc-45 58.16,33.24 CON21.4
ETH1_TX-
  Top 0.2: T2.14 81.92,58.98 81.64,58.98 arc-45 80.93,59.28 80.71,59.49 arc45 80.01,59.78 78.88,59.78 arc45 78.17,59.49 M1.J1.2
  Bottom 0.2: M1.J1.2 76.01,58.19 arc45 74.47,58.83 73.14,58.83 arc90 59.14,44.83 59.14,34.66 arc45 59.73,33.24 CON21.3
ETH3_RX+
  Top 0.2: M1.J3.3 45.34,78.03 arc45 46.04,78.32 46.34,78.62 arc90 46.34,79.96 arc-45 46.05,80.67 46.05,80.96 T1.11
  Bottom 0.2: CON13.4 106.52,137.55 106.62,137.46 arc-75 106.77,136.25 106.01,134.92 arc-15 104.42,132.85 63.21,91.64 arc-45 59.91,90.28 46.14,90.28 arc90 42.64,86.78 42.64,85.02 arc45 43.52,82.9 45.75,80.67 arc-45 46.04,79.96 46.04,79.43 arc-45 45.75,78.72 M1.J3.3
ETH3_RX-
  Top 0.2: M1.J3.6 47.58,78.04 arc-45 47.29,78.75 47.29,79.14 arc-45 47.58,79.85 47.69,79.96 arc45 47.99,80.67 47.99,80.96 T1.9
  Bottom 0.2: CON13.5 108.49,136.6 108.1,136.6 arc60 107.23,136.1 106.34,134.56 arc-15 104.75,132.49 63.51,91.24 arc-45 60.21,89.88 46.14,89.88 arc90 43.04,86.78 43.04,85.22 arc45 43.92,83.1 46.25,80.77 arc-45 46.54,80.06 46.54,79.49 arc45 46.83,78.78 M1.J3.6
ETH3_TX+
  Top 0.2: M1.J3.1 40.1,78.16 arc45 40.4,78.87 40.4,79.04 arc45 40.1,79.75 39.99,79.86 arc-45 39.7,80.57 39.7,80.96 T1.16
  Bottom 0.2: M1.J3.1 40.75,78.8 arc45 41.04,79.51 41.04,86.58 arc-90 46.14,91.68 58.14,91.68 arc45 62.16,93.34 101.66,132.84 arc45 102.54,134.97 102.54,139.31 arc45 CON13.2
ETH3_TX-
  Top 0.2: M1.J3.2 41.36,79.18 arc-90 41.36,79.88 41.49,80.01 arc45 41.64,80.36 41.64,80.96 T1.14
  Bottom 0.2: M1.J3.2 41.73,78.8 arc-45 41.44,79.51 41.44,86.48 arc-90 46.24,91.28 58.43,91.28 arc45 62.45,92.94 102.11,132.6 arc45 102.99,134.73 102.99,136.29 arc-45 103.87,138.41 CON13.3
ETH5_RX+
  Top 0.2: T3.11 27.16,56.68 27.85,56.68 arc45 28.55,56.98 28.63,57.05 arc-90 30.05,57.05 M1.J5.3
  Bottom 0.2: M1.J5.3 30.81,56.29 arc45 29.39,56.88 25.64,56.88 arc90 21.94,53.18 21.94,42.92 CON8.3
ETH5_RX-
  Top 0.2: M1.J5.6 31.06,58.12 arc-45 30.35,57.82 29.28,57.82 arc-45 28.57,58.12 28.35,58.33 arc45 27.65,58.62 27.16,58.62 T3.9
  Bottom 0.2: M1.J5.6 30.81,57.86 arc-45 29.63,57.38 25.64,57.38 arc90 21.34,53.08 21.34,46.1 arc-45 21.05,45.39 CON8.4
ETH5_TX+
  Top 0.2: M1.J5.1 31.18,50.84 arc45 30.47,51.13 29.18,51.13 arc45 28.47,50.84 28.25,50.63 arc-45 27.55,50.33 27.16,50.33 T3.16
  Bottom 0.2: M1.J5.1 30.83,51.19 arc45 29.41,51.78 27.84,51.78 arc90 24.64,48.58 24.64,38.74 CON8.1
ETH5_TX-
  Top 0.2: T3.14 27.16,52.27 27.75,52.27 arc-45 28.45,51.98 28.52,51.91 arc90 29.94,51.91 M1.J5.2
  Bottom 0.2: M1.J5.2 30.79,52.76 arc-45 29.61,52.28 27.75,52.28 arc90 24.14,48.67 24.14,42.48 arc-45 23.56,41.07 CON8.2
GND  (via drill 0.5 pad 1)  (2 unrouted)
  Top 0.2: CON19.P$1 61.74,116.28 | CON19.P$2 64.54,121.08
  other vias: 83.94,108.78 76.94,112.78 80.04,115.88 82.94,118.78 91.84,117.58 82.44,122.78 85.24,121.08 15.94,92.78 9.84,80.98 25.84,106.38 85.34,92.98 89.54,94.68 92.84,92.78 102.64,116.58 101.14,107.28 102.09,96.18 122.44,35.18 79.54,119.88 71.24,118.88 72.59,115.53 13.09,73.08 5.99,69.88 27.79,90.18 45.79,100.88 39.29,104.68 27.89,114.88 38.69,135.28 46.74,130.68 46.79,134.38 40.69,137.98 49.59,142.08 55.09,135.68 67.19,133.68 75.29,135.58 78.09,139.83 94.29,140.18 94.89,135.58 87.94,123.78 85.29,125.98 109.19,127.58 112.09,125.78 105.69,113.68 119.39,144.78 121.69,142.08 141.69,114.38 143.89,110.88 127.89,101.98 136.59,106.38 134.19,110.48 117.69,95.68 112.19,93.48 13.79,80.28 80.99,79.38 83.79,69.18 70.69,34.48 99.89,40.88 101.39,71.18 104.39,75.78 108.69,75.88 114.19,75.88 100.09,75.78 129.99,48.18 148.29,99.08 163.79,85.28 151.29,81.38 120.69,110.38 120.89,113.28 122.19,111.78 100.59,110.93 92.79,98.43 102.04,87.78 98.64,96.38 106.79,83.48 117.39,84.58 98.69,91.28 95.19,96.38 95.69,90.38 95.79,75.78 105.29,55.98 105.29,64.68 117.39,68.38 109.09,42.68 121.89,32.28 109.19,32.38 60.99,80.68 57.24,79.53 58.79,80.68 62.44,75.28 64.89,70.33 64.89,69.23 65.29,71.83 59.89,80.68 38.84,38.63 43.14,38.58 66.79,41.18 69.64,41.13 36.89,47.93 37.09,39.98 67.99,87.88 55.24,87.38 39.49,86.63 35.44,78.13 27.74,77.38 39.24,70.63 47.24,67.13 51.24,61.13 32.74,61.63 28.49,61.63 67.09,32.93 49.19,38.23 53.39,32.88 49.49,36.38 66.89,51.33 69.49,46.78 69.04,56.93 63.14,56.78 49.34,42.53 57.09,42.38 38.84,57.08 74.94,109.78 68.44,111.28 71.94,106.78 24.09,85.58 30.39,91.08 50.94,70.98 52.04,70.98 53.14,70.98 53.14,69.88 52.04,69.88 50.94,69.88 39.49,85.53 39.49,84.43 39.49,83.33 34.99,85.53 34.99,84.43 34.99,83.33 34.99,82.23 73.49,75.13 73.49,74.03 73.49,72.93 73.49,71.83 80.99,69.63 80.99,68.53 80.99,67.43 80.99,66.33 73.59,84.83 74.69,84.83 75.79,84.83 76.89,84.83 86.19,111.98 89.09,114.73 95.74,115.33
  pour Bottom (rank 3): 1.33,80.78 arc60 1.33,70.78 39.3,5 arc60 47.97,0 49.09,0 arc90 52.09,3 52.09,27.88 arc-90 53.09,28.88 146.37,28.88 170.55,70.78 arc60 170.55,80.78 132.58,146.55 arc60 123.92,151.55 47.97,151.55 arc60 39.3,146.55
  pour Top (rank 3): 1.33,80.78 arc60 1.33,70.78 39.3,5 arc60 47.97,0 49.09,0 arc90 52.09,3 52.09,27.88 arc-90 53.09,28.88 146.37,28.88 170.55,70.78 arc60 170.55,80.78 132.58,146.55 arc60 123.92,151.55 47.97,151.55 arc60 39.3,146.55
GND1  (via drill 0.5 pad 1)
  other vias: 110.09,82.48
HLK_RX0  (via drill 0.5 pad 1)
  Top 0.2: v68.44,34.28 68.03,34.69 arc45 66.61,35.28 38.77,35.28 arc-45 37.36,35.86 34.3,38.92 arc45 32.89,39.5 R14.1 32.44,39.5 32.06,39.88 arc45 31.35,40.18 30.32,40.18 arc31 29.3,39.9 24.44,37.01 arc-91 23.75,37.19 16.25,50.16 arc-90 16.99,52.9 arc90 17.54,55 16.96,55.99 arc60 15.24,56.98 13.87,56.98 CON16.2
  Bottom 0.2: MODULE2.32 71.56,53.41 arc-90 71.56,52 70.06,50.5 arc45 68.44,46.58 v68.44,34.28
  other vias: 70.94,54.03
HLK_RX1  (via drill 0.5 pad 1)
  Top 0.2: MODULE2.16 60.24,39.43 60.24,39.08 arc90 60.74,38.58 70.64,38.58 v70.94,38.88 | R6.1 v94.04,42.83
  Bottom 0.2: v70.94,38.88 70.99,38.93 71.81,38.93 arc-45 72.63,38.58 73.45,37.77 arc45 74.16,37.48 88.35,37.48 arc45 90.47,38.36 93.75,41.63 arc45 94.04,42.34 v94.04,42.83
HLK_TX0  (via drill 0.5 pad 1)
  Top 0.2: v67.04,34.28 arc45 65.83,34.78 38.57,34.78 arc-45 37.16,35.36 34.33,38.19 arc45 32.91,38.78 32.38,38.78 arc-45 31.67,39.07 31.24,39.5 R15.1 30.84,39.7 30.45,39.7 arc31 29.43,39.42 24.7,36.59 arc-91 23.32,36.95 15.17,51.07 arc-30 14.77,52.57 14.77,54.56 CON16.1
  Bottom 0.2: MODULE2.31 70.94,52.54 arc-45 70.65,51.83 69.87,51.06 arc45 67.99,46.51 67.99,36.57 arc-45 v67.04,34.28
  other vias: 70.94,52.63
HLK_TX1  (via drill 0.5 pad 1)
  Top 0.2: MODULE2.15 58.84,39.43 58.84,38.88 arc90 59.64,38.08 v71.94,38.08 | R7.1 v95.64,42.83
  Bottom 0.2: v71.94,38.08 arc-45 72.62,37.79 73.15,37.27 arc45 73.86,36.98 88.55,36.98 arc45 90.67,37.86 v95.64,42.83
I2C2_SCL
  Top 0.2: CON1.6 93.22,108.67 arc89 95.16,109.14 96.14,110.72 arc91 95.4,113.78 84.73,120.24 arc31 80.99,121.28 74.01,121.28 arc-31 72.46,121.71 71.14,122.5 D12.2 70.87,122.71 61.59,128.07 arc90 60.11,127.67 60.21,127.84 R35.2
I2C2_SDA
  Top 0.2: CON1.4 93.43,109.13 arc90 94.8,109.48 94.94,109.73 95.66,110.92 arc90 95.1,113.23 84.28,119.81 arc31 80.84,120.78 70.4,120.78 arc45 D12.1 69.74,120.76 69.74,122.15 arc60 69.19,123.1 61.41,127.59 arc90 60.49,127.35 60.28,126.98 arc-86 59.63,126.79 59.5,126.85 R36.2
LINK2
  Top 0.2: MODULE2.11 52.84,38.88 arc90 54.99,36.73 70.38,36.73 arc-45 70.74,36.58 70.8,36.52 arc45 71.15,36.38 75.49,36.38 arc90 78.79,39.68 78.79,40.95 R9.2
LINK4
  Top 0.2: MODULE2.9 50.04,38.98 arc90 52.69,36.33 70.18,36.33 arc-45 70.54,36.18 70.6,36.12 arc45 70.95,35.98 76.24,35.98 arc45 77.65,36.56 78.16,37.07 arc-45 79.57,37.65 79.74,37.65 R8.2
M1PWM
  Top 0.2: CON27.1 122.69,145.74 93.96,98.29 arc-89 90.67,97.44 CON1.50
M2PWM
  Top 0.2: CON1.52 97.39,92.77 arc31 98.93,92.34 107.41,92.34 arc-45 110.94,90.88 111.58,90.24 arc45 115.11,88.78 152.55,88.78 arc-45 159.62,85.85 CON26.1
M3PWM
  Top 0.2: CON25.1 135.19,33.03 99.36,68.86 arc-45 97.89,72.4 97.89,89.03 arc59 95.47,93.32 92.76,94.95 92.75,94.95 86.81,98.52 CON1.54
M4PWM
  Top 0.2: CON1.56 86.4,98.2 95.35,92.8 arc-59 97.34,89.28 97.34,70.5 arc45 98.81,66.96 105.48,60.29 arc-45 106.94,56.76 106.94,32.08 arc-90 106.14,31.28 92.18,31.28 arc-45 90.06,32.16 88.02,34.2 arc90 82.36,34.2 80.32,32.16 arc-45 78.2,31.28 51.89,31.28 arc90 48.99,28.38 48.99,6.7 CON24.1
M5PWM
  Top 0.2: CON1.58 87.09,97.2 arc-60 88.09,95.47 88.09,91.78 arc-90 85.89,89.58 81.1,89.58 arc-45 78.35,90.72 78.1,90.97 arc45 75.42,92.08 31.76,92.08 arc60 13.01,81.25 8.79,73.94 arc-60 6.58,72.66 CON23.1
M6PWM  (via drill 0.5 pad 1)
  Top 0.2: CON1.60 86.73,96.84 arc-60 87.59,95.36 87.59,91.78 arc-90 85.89,90.08 80.94,90.08 arc-45 78.72,91 78.28,91.44 arc45 75.53,92.58 57.27,92.58 arc-45 55.86,93.16 v55.44,93.58 | v55.44,98.18 54.66,98.96 arc45 52.69,99.78 52.07,99.78 arc-30 50.37,100.23 38.17,107.24 arc-90 36.33,114.07 39.72,119.96 arc-60 42.28,121.44 43.83,121.44 arc60 47.62,123.63 50.68,128.97 arc57 50.78,132.76 46.55,141.1 arc63 43.58,142.92 43.32,143.18 CON22.1
  Bottom 0.2: v55.44,93.58 v55.44,98.18
N$1
  Top 0.5: LED4.A 64.35,111.86 R18.2
N$2
  Top 0.2: CON4.1 60.69,85.28 arc90 63.69,82.28 73.44,82.28 arc-90 78.44,77.28 78.44,67.11 arc-45 77.86,65.69 77.61,65.44 arc-90 74.78,65.44 74.09,66.13 arc-45 73.21,68.25 CON10.1
N$3
  Top 0.5: Q1.3 BUZ1.2
N$4  (via drill 0.5 pad 1)
  Top 0.2: v93.84,47.88 94.02,48.05 94.02,49.38 R1.1
  Bottom 0.2: MODULE1.19 91.81,49.28 arc-45 92.89,48.83 v93.84,47.88
N$5
  Top 0.2: R16.2 R20.1 117.49,111.95 Q1.1
N$6  (via drill 0.5 pad 1)
  Top 0.2: v94.04,52.68 94.04,51.2 R3.1
  Bottom 0.2: MODULE1.17 91.81,51.28 arc45 93.23,51.86 v94.04,52.68
N$7
  Top 0.2: CON4.2 63.19,85.28 arc90 65.19,83.28 73.44,83.28 arc-90 79.44,77.28 79.44,67.11 arc-45 78.86,65.69 78.31,65.15 arc-90 74.07,65.15 70.94,68.28 CON10.2
N$8
  Top 0.2: R2.2 39.34,131.6 arc-87 38.25,131.3 37.74,131.58 SJ2.1
N$9
  Top 0.2: R4.1 20.17,75.45 arc-45 CON18.3
N$10
  Top 0.2: R5.1 20.38,78.04 arc-45 CON18.4
N$11
  Top 0.2: LED1.A 79.42,43.83 79.42,43.73 79.65,43.5 arc-45 79.94,42.79 R8.1
N$12
  Top 0.2: R9.1 79.04,42.4 78.55,42.9 arc-90 78.55,45.01 79.22,45.68 LED2.A
N$13
  Top 0.5: R22.P$1 113.95,128.12 113.95,128.1 115.24,127.4 arc29 117.08,126.93 118.09,126.93 BUZ1.1 118.44,126.53 arc90 120.44,124.53 126.24,124.53 R23.P$1
N$14
  Top 0.2: R10.1 LED3.A
N$15
  Top 0.2: LED5.A R11.1
N$16
  Top 0.2: MODULE2.12 54.24,38.78 arc90 55.89,37.13 70.63,37.13 arc-45 70.99,36.98 71.05,36.92 arc45 71.4,36.78 75.34,36.78 arc90 78.24,39.68 78.24,42.19 arc45 77.95,42.9 76.56,44.28 arc-45 76.27,44.99 76.27,47.33 R10.2
N$17
  Top 0.2: MODULE2.13 55.64,38.68 arc90 56.79,37.53 70.83,37.53 arc-45 71.19,37.38 71.25,37.32 arc45 71.6,37.18 74.94,37.18 arc90 77.84,40.08 77.84,41.96 arc45 77.55,42.67 76.03,44.18 arc-45 75.74,44.89 75.74,47.76 arc-45 76.25,48.98 76.39,49.13 76.47,49.2 R11.2
N$18
  Top 0.2: CON18.5 18.35,79.53 arc45 20.47,80.41 R12.1
N$20
  Top 0.2: R35.1 58.71,128.86 59.3,129.8 arc-58 60.15,130.28 60.58,130.28 arc90 61.88,131.58 61.88,133.66 CON15.3
N$21
  Top 0.2: R36.1 58.01,127.72 arc-89 57.78,128.61 59.19,131.03 arc-60 60.05,131.53 CON15.4
N$22
  Top 0.2: CON17.3 72.23,129.69 arc60 73.53,130.44 74.86,132.74 arc-90 76.91,133.29 78.85,132.17 R37.1
N$23
  Top 0.2: CON17.4 67.8,127.8 arc-45 69.09,128.33 72.07,128.33 arc60 73.37,129.08 74.42,130.9 arc-90 76.47,131.45 77.96,130.59 R38.1
N$88
  Top 0.6: IC5.1 61.29,74.18 60.73,74.18 arc-45 60.02,74.47 C56.2
N$90
  Top 0.2: R30.1 R31.1 62.92,71.98 62.92,72.6 63.19,72.88 63.19,73.78 IC5.3
N$91
  Top 0.2: R32.1 64.72,74.55 63.88,75.38 arc-45 63.59,76.09 63.59,76.38 IC5.4
OTG_DM1  (via drill 0.5 pad 1)
  Top 0.2: CON19.A7 62.29,119.49 arc-45 61.82,120.1 60.66,124.41 CON14.4 | CON1.33 84.44,105.66 72.41,112.61 65.51,116.59 arc30 65.01,116.72 v64.77,116.72 64.6,116.82 64.47,117.31 arc45 64,117.93 63.72,118.09 63.7,118.11 CON19.B7
  Bottom 0.2: v64.77,116.72 64.73,116.87 arc45 64.27,117.48 62.66,118.41 arc-45 62.19,119.02 CON14.4
OTG_DP1  (via drill 0.5 pad 1)
  Top 0.2: CON19.B6 65.31,117.75 v65.37,117.76 arc60 65.82,116.99 81.17,108.13 81.18,108.13 84.64,106.13 CON1.31 | CON19.A6 62.35,118.87 62.32,118.9 61.92,119.12 arc-45 61.46,119.73 61.12,121 arc45 60.67,121.59 60.34,121.78 59.6,122.2 CON14.3
  Bottom 0.2: v65.37,117.76 65.23,117.72 arc-45 64.47,117.82 63,118.67 arc-45 62.53,119.28 61.59,122.82 arc-45 61.69,123.58 61.99,124.1 arc90 61.62,125.47 61.11,125.77 arc90 59.74,125.4 59.18,124.44 arc45 59.08,123.68 CON14.3
P0_RX+
  Top 0.2: MODULE2.34 69.64,58.88 70.94,58.88 arc-90 71.94,57.88 71.94,52.18 arc90 72.64,51.48 74.24,51.48 arc90 74.94,52.18 74.94,54.07 arc90 74.44,54.57 73.96,54.57 T2.6
P0_RX-
  Top 0.2: T2.8 73.66,52.03 72.84,52.03 arc-90 72.34,52.53 72.34,57.98 arc90 70.84,59.48 69.14,59.48 arc90 68.64,58.98 68.64,58.53 MODULE2.35
P0_TX+
  Top 0.2: T2.1 73.36,61.52 68.44,61.52 arc90 66.44,59.52 66.44,58.93 MODULE2.36
P0_TX-
  Top 0.2: MODULE2.37 65.84,58.93 65.84,59.48 arc-90 68.34,61.98 74.44,61.98 arc-90 74.94,61.48 74.94,59.48 arc-90 74.44,58.98 73.96,58.98 T2.3
P1_RX+
  Top 0.2: MODULE2.40 60.84,58.93 60.84,61.28 arc90 55.34,66.78 52.04,66.78 arc-90 49.04,69.78 49.04,73.58 arc90 48.54,74.08 46.55,74.08 arc90 46.05,73.58 46.05,73 T1.6
P1_RX-
  Top 0.2: MODULE2.41 60.24,58.93 60.24,61.43 arc90 55.29,66.38 51.89,66.38 arc-90 48.59,69.68 48.59,72.4 T1.8
P1_TX+
  Top 0.2: MODULE2.38 63.64,58.93 63.64,62.58 arc90 58.14,68.08 51.94,68.08 arc-90 49.94,70.08 49.94,73.48 arc90 48.44,74.98 41.2,74.98 arc90 39.7,73.48 39.7,73 T1.1
P1_TX-
  Top 0.2: MODULE2.39 63.04,58.93 63.04,62.58 arc90 58.04,67.58 51.94,67.58 arc-90 49.44,70.08 49.44,73.58 arc90 48.54,74.48 43.24,74.48 arc90 42.24,73.48 42.24,73 T1.3
P2_RX+
  Top 0.2: MODULE2.42 58.04,58.93 58.04,60.33 arc90 52.99,65.38 40.74,65.38 arc-90 37.74,68.38 37.74,73.48 arc90 37.24,73.98 34.94,73.98 arc90 34.44,73.48 34.44,71.48 arc90 34.94,70.98 35.42,70.98 T4.6
P2_RX-
  Top 0.2: T4.8 36.02,72.92 36.74,72.92 arc-90 37.24,72.42 37.24,68.38 arc90 40.74,64.88 53.04,64.88 arc-90 57.44,60.48 57.44,58.93 MODULE2.43
P2_TX+
  Top 0.2: T4.1 36.12,64.33 36.73,63.73 arc45 37.44,63.43 51.74,63.43 arc-90 55.24,59.93 55.24,58.93 MODULE2.44
P2_TX-
  Top 0.2: MODULE2.45 54.64,58.93 54.64,59.88 arc90 51.64,62.88 35.44,62.88 arc-90 34.44,63.88 34.44,66.04 arc-90 34.97,66.57 35.42,66.57 T4.3
P4_RX+
  Top 0.2: T3.6 35.12,56.68 34.72,56.68 arc-90 34.14,57.26 34.14,59.68 arc-90 35.64,61.18 44.84,61.18 arc-90 46.84,59.18 46.84,58.93 MODULE2.50
P4_RX-
  Top 0.2: T3.8 34.72,58.92 34.72,59.68 arc-90 35.72,60.68 44.74,60.68 arc-90 46.24,59.18 46.24,58.93 MODULE2.51
P4_TX+
  Top 0.2: MODULE2.52 44.04,58.93 44.04,58.98 arc90 43.04,59.98 38.14,59.98 arc90 36.84,58.68 36.84,50.93 arc-90 36.24,50.33 35.72,50.33 T3.1
P4_TX-
  Top 0.2: MODULE2.53 43.44,58.93 43.44,59.08 arc90 42.94,59.58 38.24,59.58 arc90 37.24,58.58 37.24,49.98 arc-90 36.44,49.18 34.74,49.18 arc-90 34.04,49.88 34.04,51.67 arc-90 34.64,52.27 35.12,52.27 T3.3
PPM-SBUS-PROT  (via drill 0.5 pad 1)
  Top 0.2: CON1.62 86.15,96.59 arc-59 86.84,95.38 86.84,92.13 arc-45 v86.59,91.53 | v83.94,88.13 arc-45 82.98,87.73 80.2,87.73 arc-45 77.62,88.8 76.8,89.61 arc45 73.03,91.18 35.33,91.18 arc45 28.35,88.29 R12.2 | R12.2 | R12.2 25.87,87.98 D3.1
  Bottom 0.2: v83.94,88.13 86.06,90.25 arc45 v86.59,91.53
RX_2
  Top 0.2: CON29.3 36.32,32.9 arc90 34.62,34.6 arc-60 33.29,35.37 32.81,36.2 arc-30 32.54,37.2 R14.2
  Bottom 0.2: MODULE1.13 92.18,56.81 arc45 93.14,59.14 93.14,66.53 arc90 89.79,69.88 88.48,69.88 arc45 86.36,69 82.92,65.56 arc-45 80.8,64.68 68.51,64.68 arc45 64.98,63.21 46.71,44.94 arc45 45.24,41.41 45.24,39.06 arc-45 43.78,35.52 40.58,32.32 arc-45 37.05,30.86 CON29.3
RX_3
  Bottom 0.2: MODULE1.9 90.98,59.61 arc45 92.09,62.3 92.09,66.53 arc90 89.94,68.68 88.88,68.68 arc45 86.76,67.8 83.32,64.36 arc-45 81.2,63.48 68.71,63.48 arc45 65.18,62.01 47.71,44.54 arc45 46.24,41.01 46.24,34.86 arc-45 44.78,31.32 CON32.3
RX_4
  Top 0.2: MODULE1.5 91.86,62.06 arc-45 92.44,60.65 92.44,43.52 arc45 93.32,41.4 99.31,35.41 arc-45 100.19,33.28 CON5.3
SERIAL1_RX  (via drill 0.5 pad 1)
  Top 0.2: v90.74,98.78 90.74,99.77 arc60 89.79,101.42 CON1.38 | R7.2 95.34,46 95.29,46.05 95.29,49.4 R1.2 95.37,49.58 95.91,50.12 arc45 96.04,50.44 96.04,65.64 arc45 91.28,77.14 86.3,82.11 arc-45 84.84,85.65 v84.84,87.23 80.35,87.23 arc-45 77.03,88.6 76.25,89.39 arc45 72.89,90.78 36.35,90.78 arc45 30.49,88.35 29.25,87.11 D2.1 29.25,86.91 R5.2
  Bottom 0.2: v90.74,98.78 90.85,98.67 arc-45 91.14,97.96 91.14,96.47 arc-45 88.71,90.59 85.69,87.58 arc-45 v84.84,87.23
SERIAL1_TX  (via drill 0.5 pad 1)
  Top 0.2: v89.44,99.38 89.44,100.48 arc60 88.94,101.35 88.38,101.67 CON1.40 | R6.2 94.17,46 94.45,46.28 arc45 94.74,46.99 94.74,49.94 arc-45 95.03,50.65 95.37,50.98 R3.2 95.57,51.28 95.57,65.86 arc45 91.11,76.6 85.81,81.91 arc-45 84.34,85.45 arc45 84.11,86.01 v83.89,86.23 arc45 82.68,86.73 80.4,86.73 arc-45 76.63,88.29 75.85,89.06 arc45 72.69,90.38 37.51,90.38 arc45 33.73,88.81 30.89,85.97 D2.2 30.49,85.67 29.39,84.57 R4.2
  Bottom 0.2: v83.89,86.23 84.41,86.23 arc45 85.83,86.81 89.24,90.22 arc45 91.84,96.51 91.84,98.68 arc90 90.84,99.68 90.16,99.68 arc45 v89.45,99.38 v89.44,99.38
SERIAL2_RX
  Top 0.2: CON1.34 90.88,101.91 arc90 95.05,102.97 98.48,108.73 arc90 96.49,116.57 82.41,124.96 arc-59 80.94,127.54 80.94,129.17 D10.2 R38.2
SERIAL2_TX
  Top 0.2: CON1.36 90.72,101.49 arc89 95.51,102.78 98.92,108.56 arc90 96.66,116.97 83.4,124.92 arc-59 81.94,127.5 81.94,130.76 D10.1 R37.2
SERIAL3_RX  (via drill 0.5 pad 1)
  Top 0.2: v93.14,104.08 93.14,104.39 arc60 92.89,104.82 CON1.20 | v73.24,87.88 72.62,88.5 arc45 70.5,89.38 44.4,89.38 arc45 31.5,84.03 22.59,75.13 arc45 20.84,70.9 20.84,69.88 arc-90 18.44,67.48 9.1,67.48 arc120 7.69,65.03 9.23,62.36 arc60 10.96,61.36 CON16.4
  Bottom 0.2: v73.24,87.88 73.24,88.25 arc-45 73.83,89.66 75.36,91.2 arc45 76.24,93.32 76.24,99.78 arc-90 81.74,105.28 91.94,105.28 arc-90 v93.14,104.08
SERIAL3_TX  (via drill 0.5 pad 1)
  Top 0.2: v91.94,104.08 91.94,104.51 arc59 91.7,104.94 90.63,105.57 CON1.22 | v74.54,87.88 73.52,88.9 arc45 71.4,89.78 44,89.78 arc45 31.27,84.5 22.46,75.7 arc45 20.34,70.58 20.34,69.88 arc-90 18.44,67.98 9.06,67.98 arc120 7.21,64.78 9.85,60.19 arc60 11.59,59.19 CON16.3
  Bottom 0.2: v91.94,104.08 arc45 90.01,104.88 81.74,104.88 arc90 76.74,99.88 76.74,93.12 arc-45 75.86,91 75.03,90.16 arc45 74.54,88.99 v74.54,87.88
SERIAL4_RX  (via drill 0.5 pad 1)
  Top 0.2: v94.29,105.88 93.4,105.88 arc-29 92.92,106 91.38,106.85 CON1.16
  Bottom 0.2: v94.29,105.88 94.58,105.88 arc-45 95.28,105.58 104.96,95.91 arc-45 105.84,93.78 105.84,92.65 arc45 CON11.4
SERIAL4_TX  (via drill 0.5 pad 1)
  Top 0.2: v94.94,104.58 94.61,104.58 arc-30 94.11,104.71 91.28,106.33 CON1.18
  Bottom 0.2: CON11.3 105.27,93.46 arc45 104.39,95.58 95.68,104.28 arc45 94.98,104.58 v94.94,104.58
SERIAL5_RX  (via drill 0.5 pad 1)
  Top 0.2: CON1.12 92.23,107.51 arc30 92.73,107.38 96.18,107.38 arc45 v96.54,107.53
  Bottom 0.2: CON30.4 113.88,104.55 arc45 111.76,105.43 99.88,105.43 arc-45 97.76,106.31 v96.54,107.53
SERIAL5_TX  (via drill 0.5 pad 1)
  Top 0.2: v96.04,106.28 95.83,106.48 arc45 95.13,106.78 92.8,106.78 arc-30 92.27,106.92 92.12,107.01 CON1.14
  Bottom 0.2: CON30.3 112.42,102.6 arc45 110.29,103.48 100.08,103.48 arc-45 97.96,104.36 v96.04,106.28
SW
  pour Top (no thermals): 61.74,76.98 59.12,76.98 arc-45 57.71,77.56 55.74,79.53 54.34,79.53 54.34,75.83 arc90 55.34,74.83 57.31,74.83 arc45 58.73,75.41 arc-45 59.61,75.78 61.74,75.78
TX_2
  Top 0.2: R15.2 31.04,37.68 arc30 31.31,36.68 33.11,33.57 arc60 34.05,33.03 CON29.4
  Bottom 0.2: MODULE1.15 92.78,55.41 arc45 93.64,57.5 93.64,66.33 arc90 89.49,70.48 88.32,70.48 arc45 86.2,69.6 82.75,66.16 arc-45 80.63,65.28 68.41,65.28 arc45 64.88,63.81 46.21,45.14 arc45 44.74,41.61 44.74,39.57 arc-45 43.28,36.04 41.73,34.49 arc-45 38.2,33.03 CON29.4
TX_3
  Bottom 0.2: MODULE1.11 91.58,58.21 arc45 92.64,60.78 92.64,66.58 arc90 89.94,69.28 88.68,69.28 arc45 86.56,68.4 83.12,64.96 arc-45 81,64.08 68.61,64.08 arc45 65.08,62.61 47.21,44.74 arc45 45.74,41.21 45.74,37.77 arc-45 44.28,34.24 CON32.4
TX_4
  Top 0.2: MODULE1.7 91.36,60.56 arc-45 91.94,59.15 91.94,43.45 arc45 92.93,41.08 96.92,37.08 arc-45 97.69,35.22 CON5.4
USB_DM  (via drill 0.5 pad 1)
  Bottom 0.2: PAD2.1 39.44,59.74 arc45 39.73,59.03 MODULE2.55
  other vias: 40.24,58.53
USB_DP  (via drill 0.5 pad 1)
  Bottom 0.2: PAD1.1 42.44,59.74 arc-45 42.15,59.03 MODULE2.54
  other vias: 41.64,58.53
VBUS  (via drill 0.5 pad 1)
  Top 0.2: CON1.29 67.97,116.34 arc-31 66.52,117.82 v65.97,118.8 | CON19.A4 61.81,118 61.73,118.08
  Top 0.3: 61.73,118.08 58.21,120.11 CON14.2 | CON19.B4 65.63,118.71 v65.97,118.8
  Top 0.5: D1.A 54.93,115.57 arc-91 54.38,117.65 55.67,119.81 arc-87 57.65,120.38 CON14.2
  Bottom 0.5: v65.97,118.8 arc-45 66.31,118.36 66.48,117.72 arc-90 65.33,115.73 arc-45 64.26,115.87 58.41,119.24 CON14.2
VDD_3V3  (via drill 0.5 pad 1)
  Bottom 1: v58.94,69.18 58.94,65.05 arc-45 57.48,61.51 43.06,47.09 arc45 41.59,43.56 v41.59,38.53
  other vias: 58.94,71.28 58.94,70.23 40.29,38.53 40.94,37.73
  pour Top (no thermals): 60.74,72.38 55.04,72.38 55.04,68.78 60.74,68.78
  pour Bottom (no thermals): 58.54,71.68 59.34,71.68 59.34,68.73 58.54,68.73
  pour Top (no thermals): 42.04,40.28 39.84,40.28 39.84,37.33 42.04,37.33
  pour Bottom (no thermals): 39.84,38.98 42.04,38.98 42.04,37.33 39.84,37.33
VDD_4V
  Bottom 1.5: MODULE1.21 MODULE1.23 94.44,45.28 arc90 97.44,48.28 97.44,48.78 arc-45 100.73,56.72 110.67,66.66 arc-90 115.72,66.66 arc45 117.57,65.89 CON9.9 CON9.10
VDD_5V
  Top 0.5: R23.P$2 125.89,121.23 125.89,112.67 arc-45 123.54,107 CON7.6
  Bottom 1: 35.95,138.59 19.43,109.97 | 19.44,109.97 2.54,80.7 arc60 2.54,71.48 4.66,67.81 5.05,67.13 5.13,66.99 | 148.48,116.21 131.37,145.85 arc60 123.92,150.15 47.25,150.15 arc60 40.32,146.15 35.95,138.59 | 5.13,66.99 23.39,35.36 27.42,28.38 40.52,5.7 arc60 47.96,1.4 49.09,1.4 arc90 50.69,3 50.69,27.88 arc-90 53.09,30.28 78.19,30.28 arc45 80.32,31.16 82.36,33.21 arc-90 88.02,33.21 90.06,31.16 arc45 92.18,30.28 108.7,30.28 arc45 110.82,31.16 112.62,32.96 arc-90 118.27,32.96 120.07,31.16 arc45 122.19,30.28 141.28,30.28 arc60 148.21,34.28 159.82,54.39 169.26,70.75 arc60 169.26,80.42 164.59,88.5 164.59,88.53 158.7,98.59 158.6,98.69 148.48,116.21 | CON18.2 16.46,72.03 arc31 11.35,70.63 5.13,66.99 | 35.95,138.59 CON28.1 56.33,127.33 | CON17.2 67.88,131.86 arc45 64.34,130.4 62.74,128.79 arc-45 59.2,127.33 56.33,127.33 | 147.94,115.9 148.48,116.21 | 56.33,127.33 51.43,119.14 arc31 50.72,116.57 50.72,114.53 CON6.1
  Bottom 1.5: 147.94,115.9 127.41,104.07 arc-30 124.91,103.4 CON7.6 CON7.5 CON7.4 113.27,98.32 | CON11.2 104.3,86.56 arc85 106.88,87.37 113.2,98.32 113.27,98.32 | CON30.2 113.27,98.33 113.27,98.32
VDD_12V  (via drill 0.5 pad 1)
  Top 0.2: R32.2 64.94,78.28 65.04,78.38
  Top 0.5: R22.P$2 110.86,129.93 102.23,134.91 arc-60 100.23,138.38 100.23,141.2 CON13.1
  Top 0.6: IC5.5 62.44,77.28 arc-90 63.44,78.28 63.99,78.28 C4.P$2
  Top 0.8: M1.SUP 66.47,78.38 65.04,78.38 63.99,78.38 C4.P$2
  Top 1.5: CON15.2 60.9,135.86 arc60 56.57,133.36 49.41,120.97 arc-60 43.03,117.29 41.07,117.29 CON2.2 | CON5.1 105.19,38.81 arc45 103.73,42.34 98.91,47.16 arc-45 97.44,50.7 v97.44,59.58
  Bottom 1.5: CON20.1 CON20.2 CON20.3 42.27,98.51 42.24,98.48 | CON15.2 67.06,135.86 arc45 69.18,136.74 69.52,137.08 arc-45 71.65,137.96 93.83,137.96 arc45 98.54,139.91 CON13.1 | 42.24,98.48 38.51,94.74 arc45 37.04,91.21 37.04,75.98 arc90 40.04,72.98 50.99,72.98 arc90 54.99,76.98 54.99,78.28 arc-90 58.99,82.28 66.94,82.28 | 66.94,82.28 79.57,82.28 arc-45 83.11,80.81 95.98,67.94 arc-45 97.44,64.41 v97.44,58.58 | M1.SUP 66.67,82.01 66.94,82.28 | 42.24,98.48 42.24,112.07 arc60 40.74,114.67 CON2.3 CON2.2
  other vias: 97.44,57.58 97.44,56.58
  pour Bottom: 98.09,59.98 98.09,56.68 arc-90 97.59,56.18 97.29,56.18 arc-90 96.79,56.68 96.79,59.98
VDD_24V
  Top 1.5: 24.74,65.28 24.74,72.88 arc-90 26.74,74.88 32.73,74.88 arc45 33.43,75.17 34.05,75.78 arc-45 34.76,76.08 51.74,76.08 51.94,76.28 | CON12.4 CON12.5 51.94,76.28 | 51.94,76.28 CON12.6 | CON16.5 12.35,64.71 arc-27 14.66,65.28 24.74,65.28 | 24.74,65.28 24.74,53.18 arc-60 22.24,48.85 19.47,47.25 CON8.5

## Text on the board
tPlace: Connect et non queri | GND | PWM | CANL | CANH | CANH | CANL | PWM | GND | GND | 12V | 12V | ETH_TX+ | SCL | ETH_TX- | ETH_RX+ | SDA | ETH_RX- | GND | GND | 5V | 5V | TX | CANH | + | CAN1 / TERMINATION | RX | CANL | GND | GND | 12V | 12V | GND | 5V | CANH | CANL | GND | RX | TX | 5V | GND | RX | TX | 5V | GND | GND | GND | SBUS | 5V | CANL | RX | CANH | CANH | TX | CANL | PWM | 5V | GND | GND | GND | 24V | SER3_RX | SER3_TX | HLK0_RX | HLK0_TX | GND | DBG | 24V | CAM | Pegas V3.1 / Logic PCB | RX- | PL | BCKC | RX+ | TX- | TX+ | 5V | CANH | CANL | GND | TX+ | TX- | RX+ | RX- | GND | GND | TX_4 | RX_4 | CTS_4 | 12V | TX | RX | TX | CTS | RX | GND | CTS | GND | GND | CANL | CANH | PWM
bPlace: Use M3 ISO7380 screws / for everything | DM | DP | 11 mm female to female / M3 standoffs | 8 mm female to female / M3 standoffs | December 2022
tNames: CON200